# Altium schematic sheet Sheet1.SchDoc
size A4
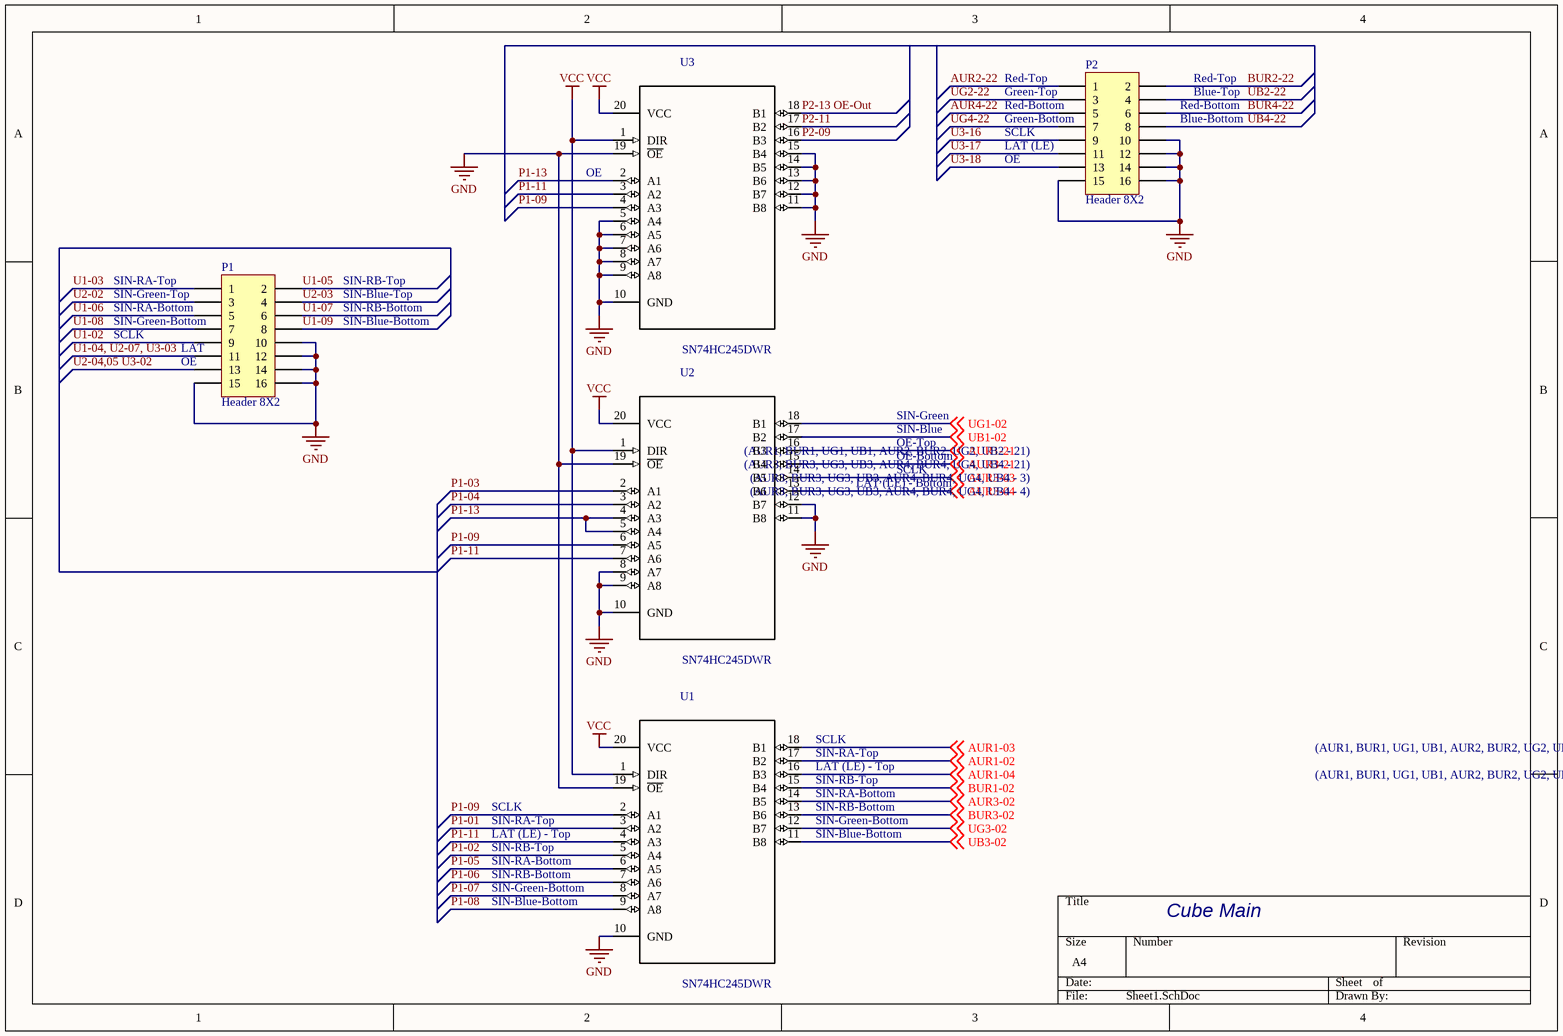
[diagram p0: Sheet1.SchDoc]

## Parts
P1  Header 8X2  [HDR2X8]
P2  Header 8X2  [HDR2X8]
U1  SN74HC245DWR  [SOIC127P1030X265-20N]
U2  SN74HC245DWR  [SOIC127P1030X265-20N]
U3  SN74HC245DWR  [SOIC127P1030X265-20N]

## Nets
GND: P1.10 P1.12 P1.14 P1.15 P1.16 P2.10 P2.12 P2.14 P2.15 P2.16 U1.10(GND) U1.19(~{OE}) U2.8(A7) U2.9(A8) U2.10(GND) U2.11(B8) U2.12(B7) U2.19(~{OE}) U3.5(A4) U3.6(A5) U3.7(A6) U3.8(A7) U3.9(A8) U3.10(GND) U3.11(B8) U3.12(B7) U3.13(B6) U3.14(B5) U3.15(B4) U3.19(~{OE})
VCC: U1.1(DIR) U1.20(VCC) U2.1(DIR) U2.20(VCC) U3.1(DIR) U3.20(VCC)
AUR1-02: U1.17(B2) ; off-sheet AUR1-02
AUR1-03: U1.18(B1) ; off-sheet AUR1-03
AUR1-04: U1.16(B3) ; off-sheet AUR1-04
AUR1-21: U2.16(B3) ; off-sheet AUR1-21
AUR2-22: P2.1
AUR3-02: U1.14(B5) ; off-sheet AUR3-02
AUR3-03: U2.14(B5) ; off-sheet AUR3-03
AUR3-04: U2.13(B6) ; off-sheet AUR3-04
AUR3-21: U2.15(B4) ; off-sheet AUR3-21
AUR4-22: P2.5
BUR1-02: U1.15(B4) ; off-sheet BUR1-02
BUR2-22: P2.2
BUR3-02: U1.13(B6) ; off-sheet BUR3-02
BUR4-22: P2.6
P1-01: U1.3(A2)
P1-02: U1.5(A4)
P1-03: U2.2(A1)
P1-04: U2.3(A2)
P1-05: U1.6(A5)
P1-06: U1.7(A6)
P1-07: U1.8(A7)
P1-08: U1.9(A8)
P1-09: U1.2(A1) U2.6(A5) U3.4(A3)
P1-11: U1.4(A3) U2.7(A6) U3.3(A2)
P1-13: U2.4(A3) U2.5(A4) U3.2(A1)
P2-09: U3.16(B3)
P2-11: U3.17(B2)
P2-13 OE-Out: U3.18(B1)
U1-02: P1.9
U1-03: P1.1
U1-04, U2-07, U3-03: P1.11
U1-05: P1.2
U1-06: P1.5
U1-07: P1.6
U1-08: P1.7
U1-09: P1.8
U2-02: P1.3
U2-03: P1.4
U2-04,05 U3-02: P1.13
U3-16: P2.9
U3-17: P2.11
U3-18: P2.13
UB1-02: U2.17(B2) ; off-sheet UB1-02
UB2-22: P2.4
UB3-02: U1.11(B8) ; off-sheet UB3-02
UB4-22: P2.8
UG1-02: U2.18(B1) ; off-sheet UG1-02
UG2-22: P2.3
UG3-02: U1.12(B7) ; off-sheet UG3-02
UG4-22: P2.7

## Notes on the sheet
- (near P2) Red-Top
- (near P2) Green-Top
- (near P2) Red-Bottom
- Red-Top
- Blue-Top
- (near U3) OE
- (near P2) Green-Bottom
- SCLK
- (near P2) LAT (LE)
- OE
- (near P2) Blue-Bottom
- (near P1) SIN-RA-Top
- (near P1) SIN-Green-Top
- (near P1) SIN-RA-Bottom
- SIN-RB-Top
- SIN-Blue-Top
- SIN-RB-Bottom
- (near P1) SIN-Green-Bottom
- (near P1) LAT
- (near P1) OE
- SIN-Blue-Bottom
- SIN-Green
- SIN-Blue
- OE-Top
- (AUR1, BUR1, UG1, UB1, AUR2, BUR2, UG2, UB2 - 21)
- LAT (LE) - Bottom
- OE-Bottom
- (AUR3, BUR3, UG3, UB3, AUR4, BUR4, UG4, UB4 - 3)
- (AUR3, BUR3, UG3, UB3, AUR4, BUR4, UG4, UB4 - 21)
- (AUR3, BUR3, UG3, UB3, AUR4, BUR4, UG4, UB4 - 4)
- (near U1) LAT (LE) - Top
- (near U1) SCLK
- (near U1) SIN-RA-Top
- (near U1) SIN-RB-Top
- (AUR1, BUR1, UG1, UB1, AUR2, BUR2, UG2, UB2 - 3)
- (AUR1, BUR1, UG1, UB1, AUR2, BUR2, UG2, UB2 - 4)
- LAT (LE) - Top
- SIN-RA-Top
- (near U1) SIN-RA-Bottom
- (near U1) SIN-RB-Bottom
- (near U1) SIN-Green-Bottom
- (near U1) SIN-Blue-Bottom
- SIN-RA-Bottom
- Cube Main

## Library data of the parts
P1 P2 = Header 8X2: Header, 8-Pin, Dual row; LatestRevisionDate: 17-Jul-2002; LatestRevisionNote: Re-released for DXP Platform.; Publisher: Altium Limited
U1-U3 = SN74HC245DWR: Logic IC - Receiver, transceiver Texas Instruments SN74HC245DWR SOIC 20; MF: Texas Instruments; Price: 0.25 USD; Availability: Good; SnapEDA_Link: https://www.snapeda.com/parts/SN74HC245DWR/Texas%20Instruments/view-part/?ref=snap; MP: SN74HC245DWR; Package: SOIC-20 Texas Instruments; Value: *